# EAGLE design L&R OSMC (EAGLE 6.4)
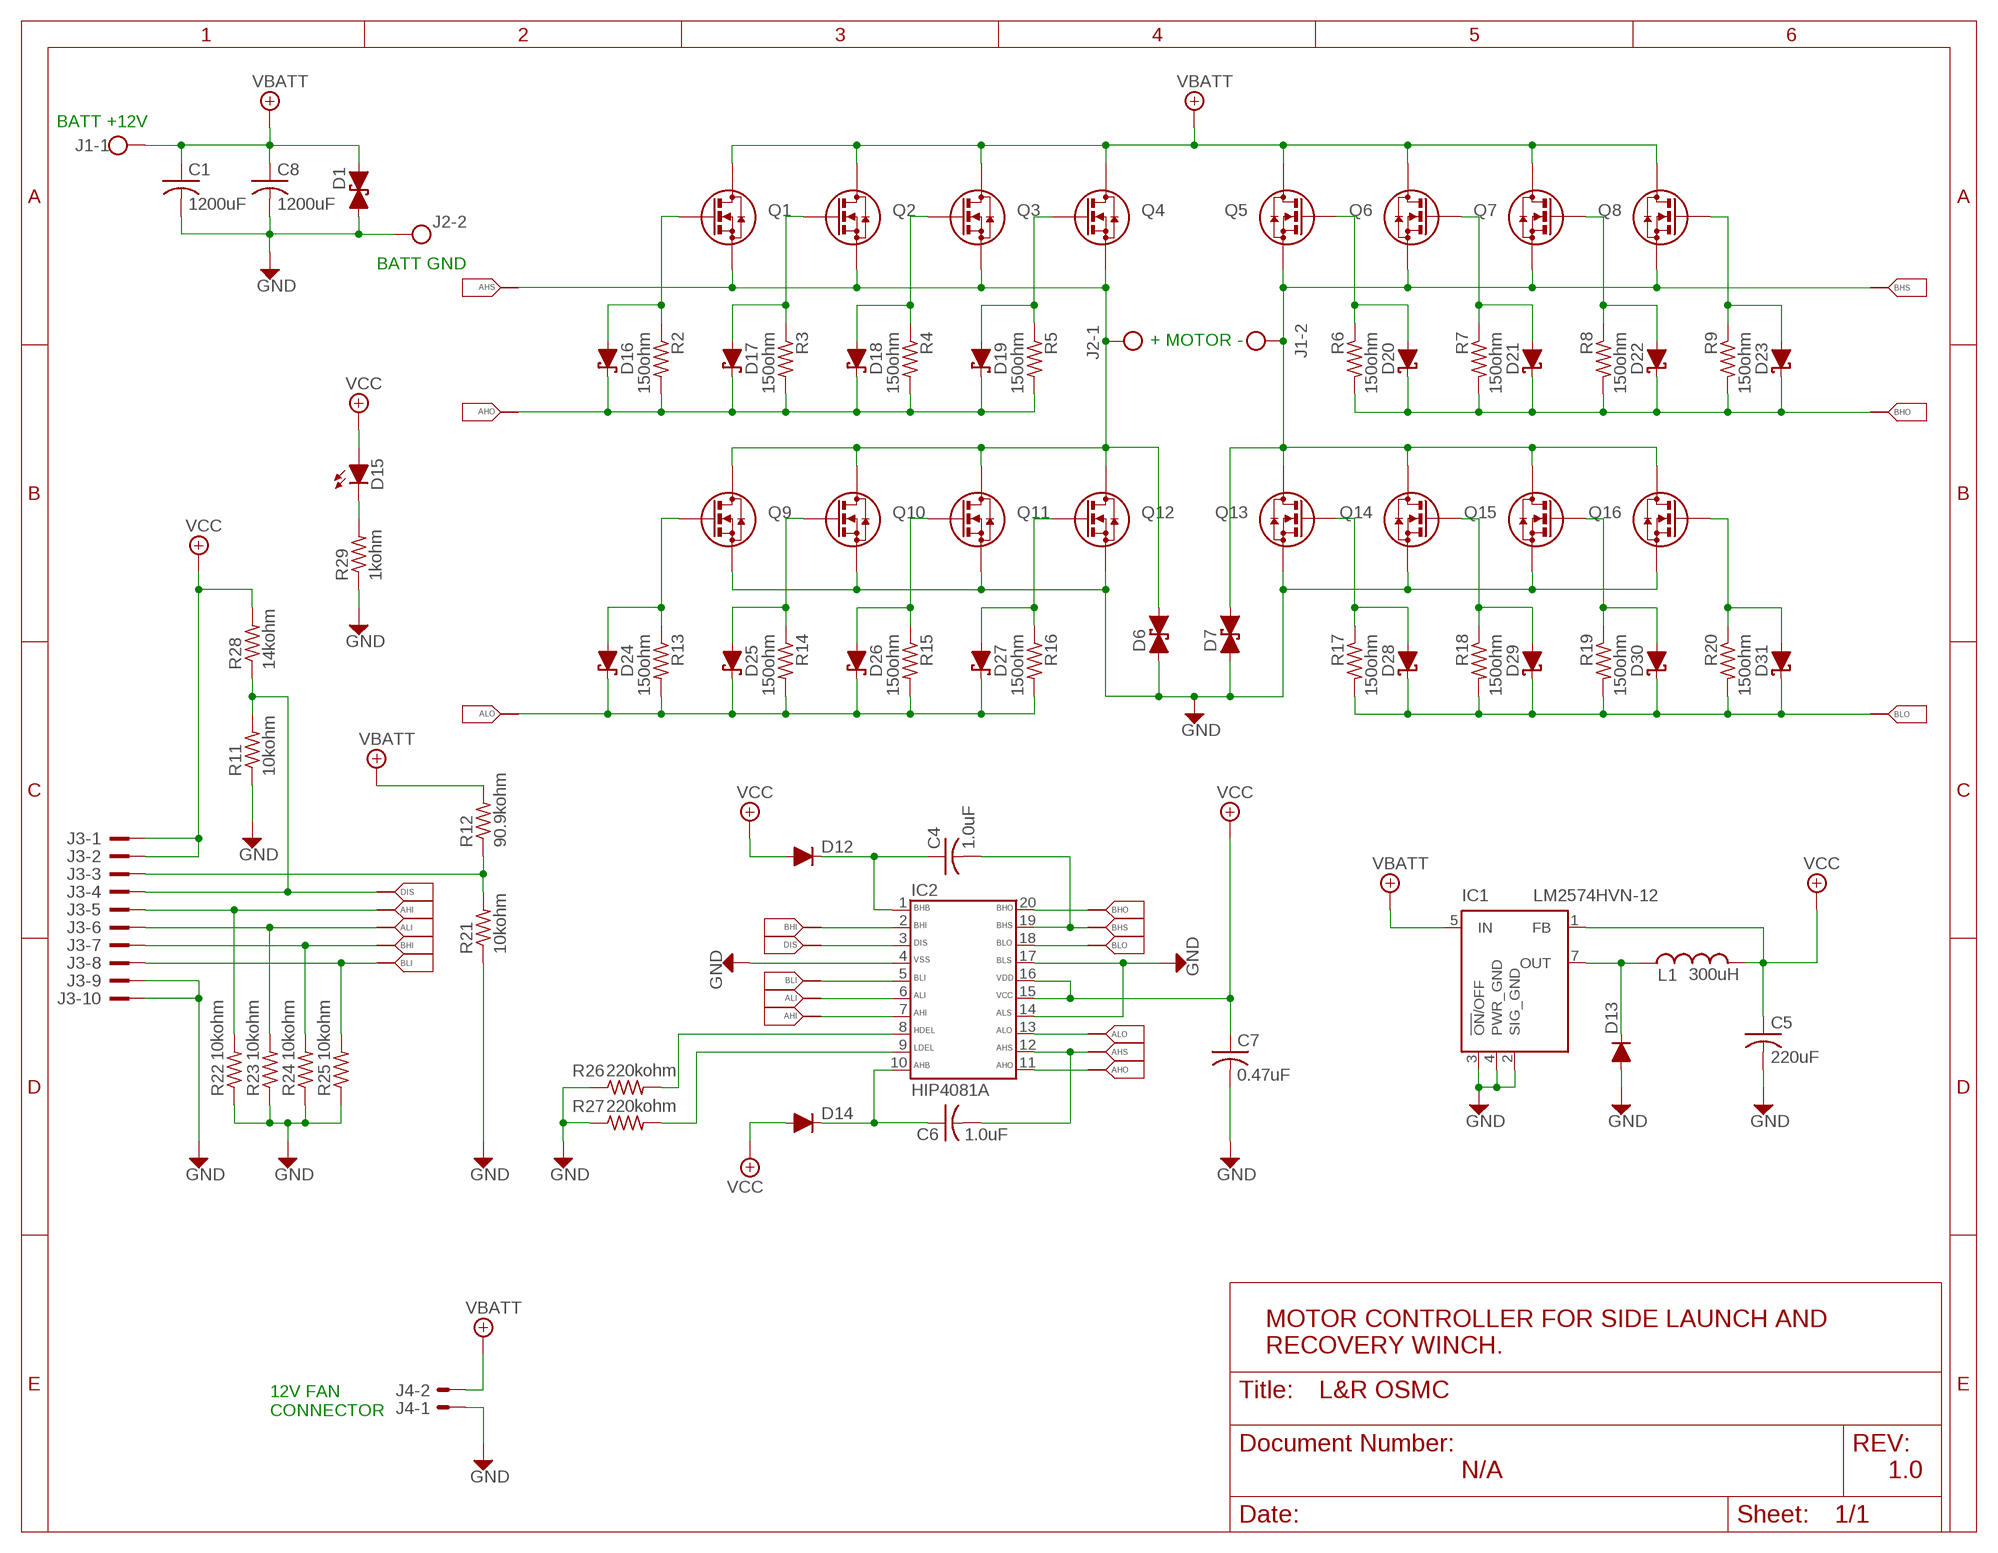
[diagram p0: schematic, sheet 1]

## Parts
C1  1200uF  C1,8  [E7,5-18]
C4  1.0uF  C4,6  [C050-075X075]
C5  220uF  C5  [E5-6]
C6  1.0uF  C4,6  [C050-075X075]
C7  0.47uF  C7  [C050-025X075]
C8  1200uF  C1,8  [E7,5-18]
D1  1.5KE51CA  [1.5KE]
D6  1.5KE51CA  [1.5KE]
D7  1.5KE51CA  [1.5KE]
D12  UF1002  [DO41]
D13  UF1002  [DO41]
D14  UF1002  [DO41]
D15  LED  [LED5MM]
D16  1N6263  [DO35-7]
D17  1N6263  [DO35-7]
D18  1N6263  [DO35-7]
D19  1N6263  [DO35-7]
D20  1N6263  [DO35-7]
D21  1N6263  [DO35-7]
D22  1N6263  [DO35-7]
D23  1N6263  [DO35-7]
D24  1N6263  [DO35-7]
D25  1N6263  [DO35-7]
D26  1N6263  [DO35-7]
D27  1N6263  [DO35-7]
D28  1N6263  [DO35-7]
D29  1N6263  [DO35-7]
D30  1N6263  [DO35-7]
D31  1N6263  [DO35-7]
IC1  LM2574HVN-12  [DIL08]
IC2  HIP4081A  [DIL20]
J1  LXXX-2  [LXXX-2]
J2  LXXX-2  [LXXX-2]
J3  3793  [3M/3793-10]
J4  22-23-2021  [22-23-2021]
L1  300uH  L1  [L06X18]
Q1  IRF14051-16  [TO-220AB]
Q2  IRF14051-16  [TO-220AB]
Q3  IRF14051-16  [TO-220AB]
Q4  IRF14051-16  [TO-220AB]
Q5  IRF14051-16  [TO-220AB]
Q6  IRF14051-16  [TO-220AB]
Q7  IRF14051-16  [TO-220AB]
Q8  IRF14051-16  [TO-220AB]
Q9  IRF14051-16  [TO-220AB]
Q10  IRF14051-16  [TO-220AB]
Q11  IRF14051-16  [TO-220AB]
Q12  IRF14051-16  [TO-220AB]
Q13  IRF14051-16  [TO-220AB]
Q14  IRF14051-16  [TO-220AB]
Q15  IRF14051-16  [TO-220AB]
Q16  IRF14051-16  [TO-220AB]
R2  150ohm  R  [0207/7]
R3  150ohm  R  [0207/7]
R4  150ohm  R  [0207/7]
R5  150ohm  R  [0207/7]
R6  150ohm  R  [0207/7]
R7  150ohm  R  [0207/7]
R8  150ohm  R  [0207/7]
R9  150ohm  R  [0207/7]
R11  10kohm  R  [0207/7]
R12  90.9kohm  R  [0207/7]
R13  150ohm  R  [0207/7]
R14  150ohm  R  [0207/7]
R15  150ohm  R  [0207/7]
R16  150ohm  R  [0207/7]
R17  150ohm  R  [0207/7]
R18  150ohm  R  [0207/7]
R19  150ohm  R  [0207/7]
R20  150ohm  R  [0207/7]
R21  10kohm  R  [0207/7]
R22  10kohm  R  [0207/7]
R23  10kohm  R  [0207/7]
R24  10kohm  R  [0207/7]
R25  10kohm  R  [0207/7]
R26  220kohm  R  [0207/7]
R27  220kohm  R  [0207/7]
R28  14kohm  R  [0207/7]
R29  1kohm  R  [0207/7]

## Nets
+12V: C5.+ C7.1 D12.A D14.A D15.A IC1.1(FB) IC2.15 IC2.16 J3.P$1 J3.P$2 L1.2 R28.2 ; supply symbol labelled VCC
AHI: IC2.7 J3.P$5 R22.2
AHO: D16.C D17.C D18.C D19.C IC2.11 R2.2 R3.2 R4.2 R5.2
AHS: C6.2 D6.C IC2.12 J2.P$1 J2.P$2 J2.P$3 J2.P$4 Q1.D Q2.D Q3.D Q4.D Q9.S Q10.S Q11.S Q12.S
ALI: IC2.6 J3.P$6 R23.2
ALO: D24.C D25.C D26.C D27.C IC2.13 R13.2 R14.2 R15.2 R16.2
BHI: IC2.2 J3.P$7 R24.2
BHO: D20.C D21.C D22.C D23.C IC2.20 R6.2 R7.2 R8.2 R9.2
BHS: C4.2 D7.C IC2.19 J1.P$5 J1.P$6 J1.P$7 J1.P$8 Q5.D Q6.D Q7.D Q8.D Q13.S Q14.S Q15.S Q16.S
BLI: IC2.5 J3.P$8 R25.2
BLO: D28.C D29.C D30.C D31.C IC2.18 R17.2 R18.2 R19.2 R20.2
DIS: IC2.3 J3.P$4 R11.2 R28.1
GND: C1.- C5.- C7.2 C8.- D1.A D6.A D7.A D13.A IC1.2(SIG_GND) IC1.3(!ON!/OFF) IC1.4(PWR_GND) IC2.4 IC2.14 IC2.17 J2.P$5 J2.P$6 J2.P$7 J2.P$8 J3.P$9 J3.P$10 J4.1 Q9.D Q10.D Q11.D Q12.D Q13.D Q14.D Q15.D Q16.D R11.1 R21.1 R22.1 R23.1 R24.1 R25.1 R26.1 R27.1 R29.1
N$1: D13.C IC1.7(OUT) L1.1
N$2: C4.1 D12.C IC2.1
N$3: D16.A Q1.G R2.1
N$4: D23.A Q8.G R9.1
N$5: D17.A Q2.G R3.1
N$6: D18.A Q3.G R4.1
N$7: D19.A Q4.G R5.1
N$8: D22.A Q7.G R8.1
N$9: D21.A Q6.G R7.1
N$10: D20.A Q5.G R6.1
N$14: IC2.9 R27.2
N$15: D24.A Q9.G R13.1
N$16: D25.A Q10.G R14.1
N$17: D26.A Q11.G R15.1
N$18: D27.A Q12.G R16.1
N$20: IC2.8 R26.2
N$21: D31.A Q16.G R20.1
N$22: D30.A Q15.G R19.1
N$23: D29.A Q14.G R18.1
N$24: D28.A Q13.G R17.1
N$27: D15.K(C) R29.2
N$28: C6.1 D14.C IC2.10
N$34: J3.P$3 R12.1 R21.2
VBATT: C1.+ C8.+ D1.C IC1.5(IN) J1.P$1 J1.P$2 J1.P$3 J1.P$4 J4.2 Q1.S Q2.S Q3.S Q4.S Q5.S Q6.S Q7.S Q8.S R12.2

## Notes on the sheet
- BATT +12V
- BATT GND
- + MOTOR -
- MOTOR CONTROLLER FOR SIDE LAUNCH AND
  RECOVERY WINCH.
- 12V FAN
  CONNECTOR
- N/A | 1.0

## Library data of the parts
C1 C8 = OSMC:C: Capacitor; DIGIKEY: P11276-ND; MF: Panasonic; MPN: EEU-FC1J681S
C4 C6 = OSMC:C: Capacitor; DIGIKEY: P4675-ND; MF: Panasonic; MPN: ECQ-V1H105JL
C5 = OSMC:C: Capacitor; DIGIKEY: P5139-ND; MF: Panasonic; MPN: ECA-1CM221
C7 = OSMC:C: Capacitor; DIGIKEY: 445-8605-ND; MF: TDK Corporation; MPN: FK28X5R1C474K
D1 D6 D7 = OSMC:1.5KE51CA: Vishay Transient Voltage Supressor Diode; DIGIKEY: 1.5KE51CA-E3/54GICT-ND; MF: Vishay; MPN: 1.5KE51CA-E3/54
D12-D14 = OSMC:UF1002: Diodes Inc. Diode Ultra-fast rectifier, 1.0A 100V; DIGIKEY: UFF1002DICT-ND; MF: Diodes Inc.; MPN: UF1002-T
D15 = Winch OSMC:LED
D16-D31 = OSMC:1N6263
IC1 = Winch OSMC:LM2574?-*: SIMPLE SWITCHER 0.5A Step-Down Voltage Regulator Source: http://cache.national.com/ds/LM/LM2574.pdf
IC2 = OSMC:HIP4081A: IC Driver, FET Full Bridge 20DIP; DIGIKEY: HIP4081A1PZ-ND; MF: Intersil; MPN: HIP4081AIPZ
J1 J2 = OSMC:LXXX-2: Weidmuller Wire to PCB Terminal High-current; DIGIKEY: 281-2876-ND; MF: Weidmuller; MPN: 1047290000
J3 = OSMC:3793: 3M Rectangular 10 Pin Header; DIGIKEY: MHS10K-ND; MF: 3M; MPN: 3793-6002
J4 = Winch OSMC:22-23-2021: .100" (2.54mm) Center Header - 2 Pin; DIGIKEY: WM4200-ND; MF: MOLEX; MPN: 22-23-2021
L1 = OSMC:L; DIGIKEY: DN7733-ND; MF: API Delevan; MPN: 2474R-31L
Q1-Q16 = OSMC:IRF1405: N-CHANNEL HEXFET POWER MOSFET; DIGIKEY: IRF1405PBF-ND; MF: International Rectifier; MPN: IRF1405PBF
R2-R9 R11-R29 = OSMC:R

## Board
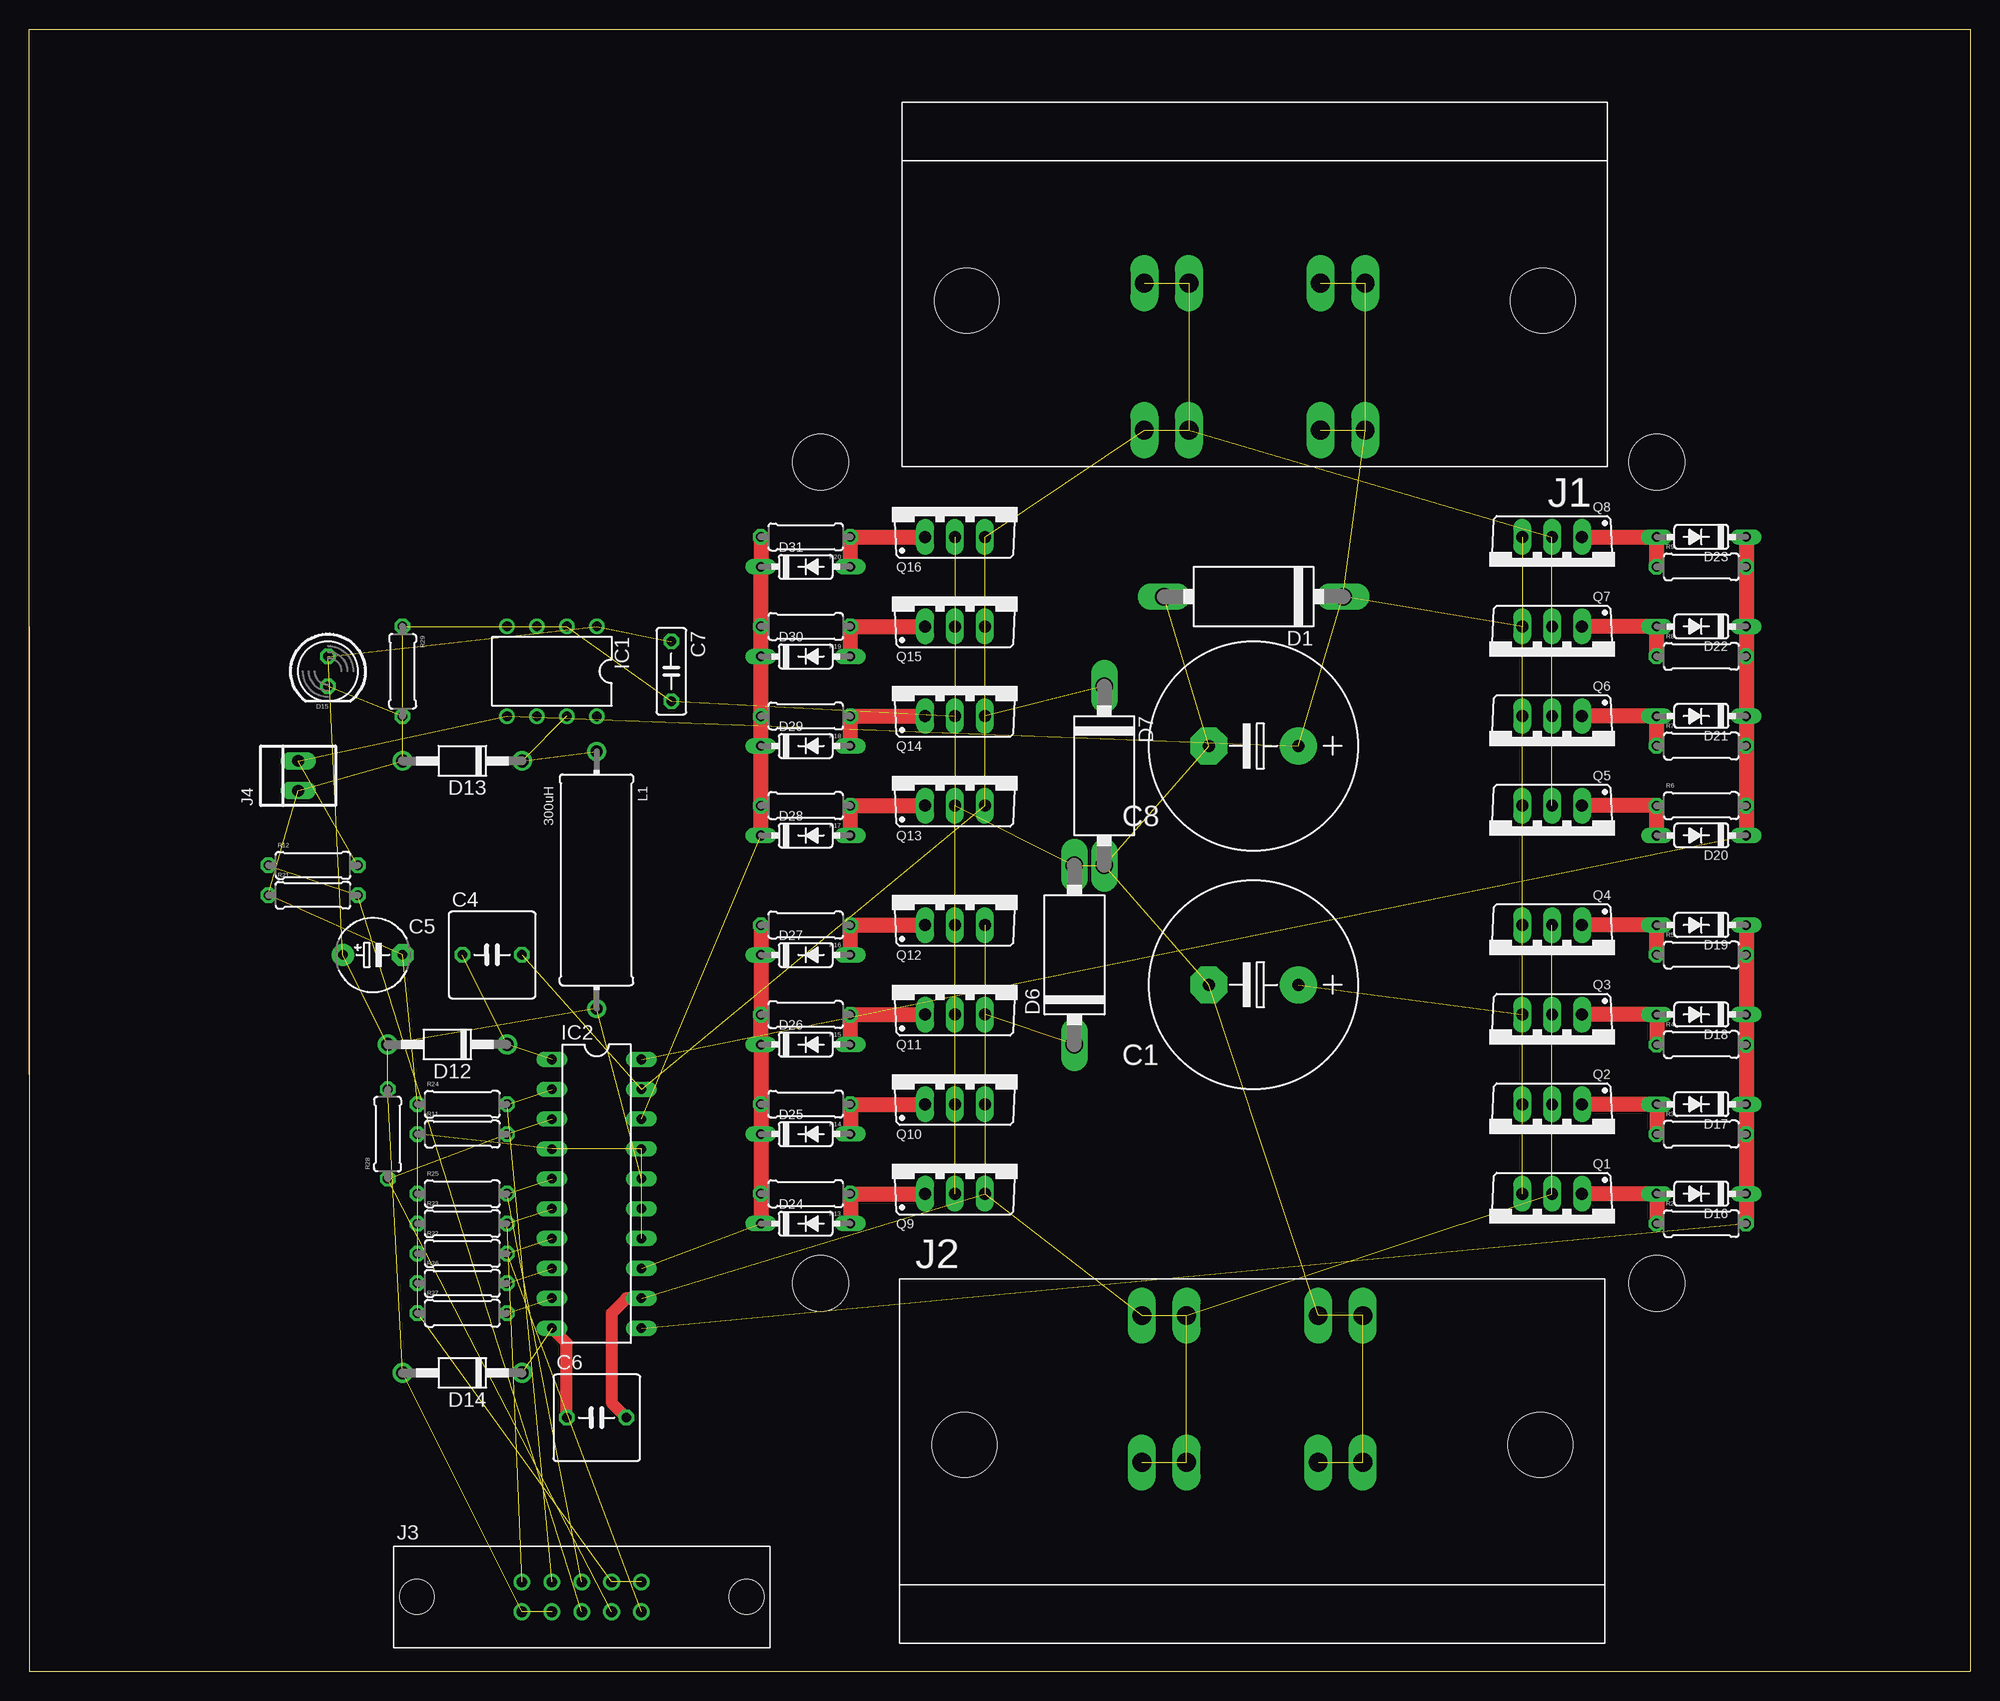
[diagram p1: board, top side]

Size 165.1 x 139.7 mm. Coordinates in mm from the lower left corner, seen from the top.
Outline: 114.3,0 0,0 0,88.9
Outline: 165.1,50.8 165.1,139.7 76.2,139.7
Outline: 76.2,0 165.1,0 165.1,88.9
Outline: 0,50.8 0,139.7 88.9,139.7
Copper layers (1*16): Top 0.035mm / dielectric 1.5mm / Bottom 0.035mm
Design rules "default": minimum track width 10mil, minimum drill 24mil, track to track 8mil, track to pad 8mil, pad to pad 8mil, via to via 8mil, smd to smd 8mil, copper to edge 40mil, drill to drill 8mil, minimum pad ring 10mil, minimum via ring 8mil, stop-mask expansion 4mil, vias tented up to drill 0mil, thermal gap 10mil
Holes 4.75 mm at 138.43,102.87 67.31,102.87 67.31,33.02 138.43,33.02

### Footprints (pad centres in the part's own frame; a part is rotated, then mirrored left to right if it is on the bottom)
E7,5-18 = drill 1.016 pad 3.15: + -3.81,0 | drill 1.016 pad 3.15 octagon: - 3.81,0
C050-075X075 = drill 0.813 octagon: 1 -2.54,0; 2 2.54,0
E5-6 = drill 0.813 pad 1.905: + -2.54,0 | drill 0.813 pad 1.905 octagon: - 2.54,0
C050-025X075 = drill 0.813 octagon: 1 -2.54,0; 2 2.54,0
1.5KE = drill 1.499 long: A 7.62,0; C -7.62,0
DO41 = drill 1.118: A 5.08,0; C -5.08,0
LED5MM = drill 0.813 octagon: A -1.27,0; K 1.27,0
DO35-7 = drill 0.813 long: A 3.81,0; C -3.81,0
DIL08 = drill 0.813 pad 1.27: 1 -3.81,-3.81; 2 -1.27,-3.81; 3 1.27,-3.81; 4 3.81,-3.81; 5 3.81,3.81; 6 1.27,3.81; 7 -1.27,3.81; 8 -3.81,3.81
DIL20 = drill 0.813 long: 1 -11.43,-3.81; 2 -8.89,-3.81; 3 -6.35,-3.81; 4 -3.81,-3.81; 5 -1.27,-3.81; 6 1.27,-3.81; 7 3.81,-3.81; 8 6.35,-3.81; 9 8.89,-3.81; 10 11.43,-3.81; 11 11.43,3.81; 12 8.89,3.81; 13 6.35,3.81; 14 3.81,3.81; 15 1.27,3.81; 16 -1.27,3.81; 17 -3.81,3.81; 18 -6.35,3.81; 19 -8.89,3.81; 20 -11.43,3.81
LXXX-2 = drill 1.6 long: P$1 -9.5,12.5; P$2 -5.7,12.5; P$3 -9.5,0; P$4 -5.7,0; P$5 5.5,12.5; P$6 9.3,12.5; P$7 5.5,0; P$8 9.3,0 | hole 5.5: -24.6,1.5; 24.4,1.5
3M/3793-10 = drill 0.9: P$1 -5.08,-1.27; P$2 -2.54,-1.27; P$3 0,-1.27; P$4 2.54,-1.27; P$5 5.08,-1.27; P$6 -5.08,1.27; P$7 -2.54,1.27; P$8 0,1.27; P$9 2.54,1.27; P$10 5.08,1.27 | hole 2.946: 14.021,0; -14.021,0
22-23-2021 = drill 1 long: 1 -1.27,0; 2 1.27,0
L06X18 = drill 1 pad 1.6: 1 -10.958,-0.004; 2 10.92,0
TO-220AB = drill 1.016 long: D 0,-2.54; G -2.54,-2.54; S 2.54,-2.54
0207/7 = drill 0.813 octagon: 1 -3.81,0; 2 3.81,0

### Placement (x,y rotation side)
C1  104.14,58.42 180 top
C4  39.37,60.96 0 top
C5  29.21,60.96 0 top
C6  48.26,21.59 0 top
C7  54.61,85.09 270 top
C8  104.14,78.74 180 top
D1  104.14,91.44 180 top
D6  88.9,60.96 90 top
D7  91.44,76.2 270 top
D12  35.56,53.34 180 top
D13  36.83,77.47 180 top
D14  36.83,25.4 180 top
D15  25.4,85.09 270 top
D16  142.24,40.64 180 top
D17  142.24,48.26 180 top
D18  142.24,55.88 180 top
D19  142.24,63.5 180 top
D20  142.24,71.12 180 top
D21  142.24,81.28 180 top
D22  142.24,88.9 180 top
D23  142.24,96.52 180 top
D24  66.04,38.1 0 top
D25  66.04,45.72 0 top
D26  66.04,53.34 0 top
D27  66.04,60.96 0 top
D28  66.04,71.12 0 top
D29  66.04,78.74 0 top
D30  66.04,86.36 0 top
D31  66.04,93.98 0 top
IC1  44.45,85.09 180 top
IC2  48.26,40.64 270 top
J1  104.14,118.11 180 top
J2  104.14,17.78 0 top
J3  46.99,6.35 0 top
J4  22.86,76.2 90 top
L1  48.26,67.31 270 top
Q1  129.54,38.1 180 top
Q2  129.54,45.72 180 top
Q3  129.54,53.34 180 top
Q4  129.54,60.96 180 top
Q5  129.54,71.12 180 top
Q6  129.54,78.74 180 top
Q7  129.54,86.36 180 top
Q8  129.54,93.98 180 top
Q9  78.74,43.18 0 top
Q10  78.74,50.8 0 top
Q11  78.74,58.42 0 top
Q12  78.74,66.04 0 top
Q13  78.74,76.2 0 top
Q14  78.74,83.82 0 top
Q15  78.74,91.44 0 top
Q16  78.74,99.06 0 top
R2  142.24,38.1 0 top
R3  142.24,45.72 0 top
R4  142.24,53.34 0 top
R5  142.24,60.96 0 top
R6  142.24,73.66 0 top
R7  142.24,78.74 0 top
R8  142.24,86.36 0 top
R9  142.24,93.98 0 top
R11  36.83,45.72 0 top
R12  24.13,68.58 0 top
R13  66.04,40.64 180 top
R14  66.04,48.26 180 top
R15  66.04,55.88 180 top
R16  66.04,63.5 180 top
R17  66.04,73.66 180 top
R18  66.04,81.28 180 top
R19  66.04,88.9 180 top
R20  66.04,96.52 180 top
R21  24.13,66.04 0 top
R22  36.83,35.56 0 top
R23  36.83,38.1 0 top
R24  36.83,48.26 0 top
R25  36.83,40.64 0 top
R26  36.83,33.02 0 top
R27  36.83,30.48 0 top
R28  30.48,45.72 90 top
R29  31.75,85.09 270 top

### Tracks (layer width: path | path; a pad name or v marks a point on that pad's centre or on a via)
+12V  (11 unrouted)
AHI  (2 unrouted)
AHO  (1 unrouted)
  Top 1.27: D19.C R5.2 D18.C R4.2 D17.C R3.2 D16.C R2.2
AHS  (13 unrouted)
  Top 1.016: IC2.12 50.8,31.75 49.53,30.48 49.53,22.86 C6.2
ALI  (2 unrouted)
ALO  (1 unrouted)
  Top 1.27: R16.2 D27.C R15.2 D26.C R14.2 D25.C R13.2 D24.C
BHI  (2 unrouted)
BHO  (1 unrouted)
  Top 1.27: D23.C R9.2 D22.C R8.2 D21.C R7.2 R6.2 D20.C
BHS  (14 unrouted)
BLI  (2 unrouted)
BLO  (1 unrouted)
  Top 1.27: D28.C R17.2 D29.C R18.2 D30.C R19.2 D31.C R20.2
DIS  (3 unrouted)
GND  (37 unrouted)
N$1  (2 unrouted)
N$2  (2 unrouted)
N$3
  Top 1.27: R2.1 D16.A Q1.G
N$4
  Top 1.27: R9.1 D23.A Q8.G
N$5
  Top 1.27: R3.1 D17.A Q2.G
N$6
  Top 1.27: R4.1 D18.A Q3.G
N$7
  Top 1.27: R5.1 D19.A Q4.G
N$8
  Top 1.27: R8.1 D22.A Q7.G
N$9
  Top 1.27: R7.1 D21.A Q6.G
N$10
  Top 1.27: D20.A R6.1 Q5.G
N$14  (1 unrouted)
N$15
  Top 1.27: D24.A R13.1 Q9.G
N$16
  Top 1.27: Q10.G R14.1 D25.A
N$17
  Top 1.27: D26.A R15.1 Q11.G
N$18
  Top 1.27: Q12.G R16.1 D27.A
N$20  (1 unrouted)
N$21
  Top 1.27: D31.A R20.1 Q16.G
N$22
  Top 1.27: D30.A R19.1 Q15.G
N$23
  Top 1.27: D29.A R18.1 Q14.G
N$24
  Top 1.27: D28.A R17.1 Q13.G
N$27  (1 unrouted)
N$28  (1 unrouted)
  Top 1.016: C6.1 45.72,27.94 IC2.10
N$34  (2 unrouted)
VBATT  (17 unrouted)